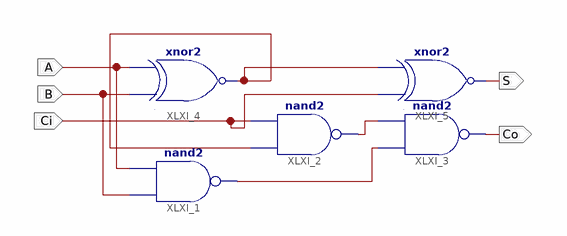
[diagram p0: schematic sheet 1]
// Xilinx ISE schematic ffffffffffffffff.sch (xa9500xl) as structural Verilog: 5 symbols, 5 ports
module ffffffffffffffff (
  input  A,
  input  B,
  input  Ci,
  output S,
  output Co
);

  wire XLXN_7, XLXN_14, XLXN_15;

  nand XLXI_1 (XLXN_15, B, A);
  nand XLXI_2 (XLXN_14, XLXN_7, Ci);
  nand XLXI_3 (Co, XLXN_15, XLXN_14);
  xnor XLXI_4 (XLXN_7, B, A);
  xnor XLXI_5 (S, Ci, XLXN_7);
endmodule
